# EasyEDA Pro project MeasuringCircuit_Hardware.epro

# Schematic powerdetect
Board Name: Board2; Create Date: 2025-07-30; Page Name: P1; Project Name: 25电赛工程; Schematic Name: powerdetect; Update Date: 2025-07-30; Company: 嘉立创EDA; Page Size: A4; Version: V1.0
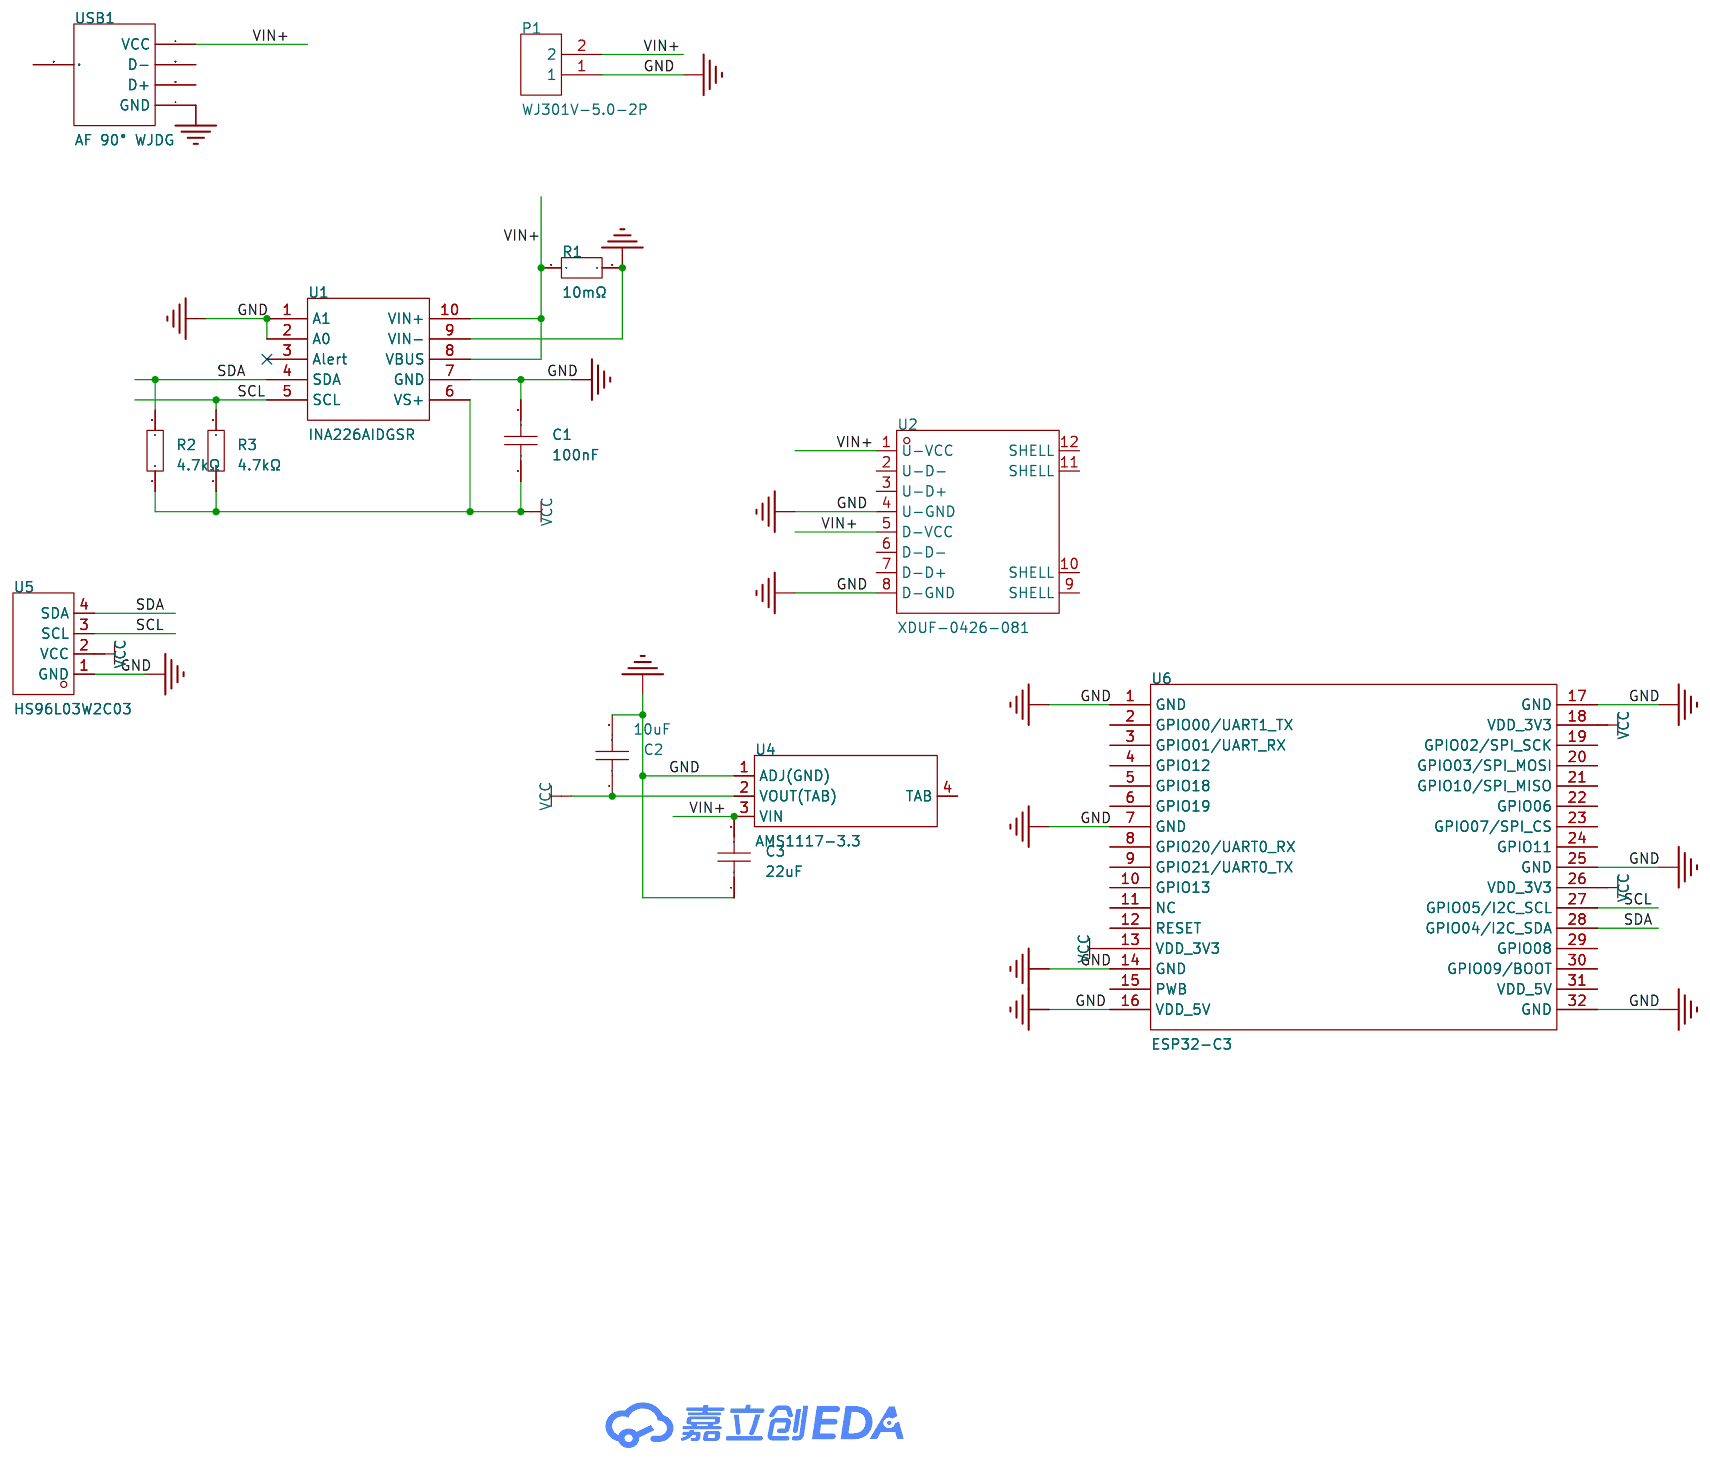
[diagram p0: schematic sheet]

## Parts
C1  100nF  [C0603]
C2  10uF  [C0603]
C3  22uF  [C0603]
P1  WJ301V-5.0-2P  [CONN-TH_2P-P5.00_WJ301V-5.00-2P]
R1  10mΩ  [R2512]
R2  4.7kΩ  [R0603]
R3  4.7kΩ  [R0603]
U1  INA226AIDGSR  [MSOP-10_L3.0-W3.0-P0.50-LS5.0-BL]
U2  XDUF-0426-081  [USB-A-TH_XDUF-0426-081]
U4  AMS1117-3.3  [SOT-223-4_L6.5-W3.5-P2.30-LS7.0-BR]
U5  HS96L03W2C03  [OLED-TH_L27.8-W27.2-P2.54_C9900033791]
U6  ESP32-C3  [ESP32-C3 114514]
USB1  AF 90° WJDG  [USB-A-TH_AF-WJDG]

## Library data of the parts
C1 = CC0603KRX7R9BB104: 容值:100nF;精度:±10%;额定电压:50V;温度系数:X7R;; LCSC Part Name: 100nF ±10% 50V; Supplier Part: C14663; Manufacturer: YAGEO(国巨); Supplier Footprint: 0603; JLCPCB Part Class: 基础库; Datasheet: https://atta.szlcsc.com/upload/public/pdf/source/20250214/096C4C206003071F5D32E5F0D8E7F8DF.pdf; Supplier: LCSC; Tolerance: ±10%; Voltage Rating: 50V; Temperature Coefficient: X7R
C2 = CGA0603X5R106K100JT: 容值:10uF;精度:±10%;额定电压:10V;温度系数:X5R;; LCSC Part Name: 10uF ±10% 10V; Supplier Part: C6119842; Manufacturer: HRE(芯声); Supplier Footprint: 0603; JLCPCB Part Class: 扩展库; Supplier: LCSC; Tolerance: ±10%; Voltage Rating: 10V; Temperature Coefficient: X5R
C3 = CGA0603X5R226M160JT: 容值:22uF;精度:±20%;额定电压:16V;温度系数:X5R;; LCSC Part Name: 22uF ±20% 16V; Supplier Part: C6119868; Manufacturer: HRE(芯声); Supplier Footprint: 0603; JLCPCB Part Class: 扩展库; Datasheet: https://atta.szlcsc.com/upload/public/pdf/source/20250121/36E435B8815E1026A710792D223DB526.pdf; Supplier: LCSC; Tolerance: ±20%; Voltage Rating: 16V; Temperature Coefficient: X5R
P1 = WJ301V-5.0-2P: 结构:1x2P;间距:5mm;颜色:蓝色;安装方式:直插;额定电流:17.5A;额定电压:250V;排数:1;线规 - AWG:14~22;线规 - 平方毫米:1.5;每排PIN数:2;工作温度范围:-30℃~+120℃;; LCSC Part Name: 5mm 1x2P 排数:1 每排P数:2 直插; Supplier Part: C8475; Manufacturer: KANGNEX(康奈克斯电气); Supplier Footprint: 插件,P=5mm; JLCPCB Part Class: 扩展库; Datasheet: https://atta.szlcsc.com/upload/public/pdf/source/20191225/C8475_44061C6AEE590DF3BFA2B6A28FAAB4F6.pdf; Supplier: LCSC; Structure: 1x2P; Pitch: 5mm; Color: 蓝色; Mounting Style: 直插; Current Rating (Max): 17.5A; Voltage Rating (Max): 250V; Number of Pins: 2P; Number of Rows: 1; Wire Gauge - AWG: 14~22; Wire Gauge - mm2: 1.5; Number of PINs Per Row: 2; Operating Temperature Range: -30℃~+120℃
R1 = YLR12-3-10F-W: 电阻类型:采样电阻;阻值:10mΩ;精度:±1%;额定压降:-;功率:3W;温度系数:±50ppm/℃;安装方式:贴片;; LCSC Part Name: 10mΩ ±1% 3W; Supplier Part: C489549; Manufacturer: yezhan(业展); Supplier Footprint: 2512; JLCPCB Part Class: 扩展库; Datasheet: https://atta.szlcsc.com/upload/public/pdf/source/20231030/FDDF433E22E82EEBC046C11DFDF78AD5.pdf; Supplier: LCSC; Type: 采样电阻; Tolerance: ±1%; Power(Watts): 3W; Temperature Coefficient: ±50ppm/℃; Mounting Sytle: 贴片
R2 R3 = 0603WAF4701T5E: 电阻类型:厚膜电阻;阻值:4.7kΩ;精度:±1%;功率:100mW;最大工作电压:75V;温度系数:±100ppm/℃;; LCSC Part Name: 4.7kΩ ±1% 100mW 厚膜电阻; Supplier Part: C23162; Manufacturer: UNI-ROYAL(厚声); Supplier Footprint: 0603; JLCPCB Part Class: 基础库; Datasheet: https://atta.szlcsc.com/upload/public/pdf/source/20200306/C422600_1E6D84923E4A46A82E41ADD87F860B5C.pdf; Supplier: LCSC; Type: 厚膜电阻; Tolerance: ±1%; Power(Watts): 100mW; Overload Voltage (Max): 75V; Temperature Coefficient: ±100ppm/℃; Operating Temperature Range: -55℃~+155℃
U1 = INA226AIDGSR: 放大器数:-;共模电压:300mV~40V;增益:-;带宽:-;; Supplier Part: C49851; Manufacturer: TI(德州仪器); Supplier Footprint: MSOP-10; JLCPCB Part Class: 扩展库; Datasheet: https://atta.szlcsc.com/upload/public/pdf/source/20231204/F50A9EB86BE78FEA83E070C913617774.pdf; Supplier: LCSC; Vcm - Common Mode Voltage: 300mV~40V; Voltage - Supply: 2.7V~5.5V; Operating Temperature: -40℃~+125℃
U2 = XDUF-0426-081: 连接器类型:Type-A;标准:USB 2.0;公母:母;安装方式:弯插;触点数量:8P;端口数量:2;额定电流 - 电源:3A;触头材质:-;触头镀层:金;工作温度范围:-40℃~+85℃;; LCSC Part Name: Type-A 母 弯插; Supplier Part: C18202150; Manufacturer: LX(连欣科技); Supplier Footprint: 插件; JLCPCB Part Class: 扩展库; Datasheet: https://atta.szlcsc.com/upload/public/pdf/source/20230927/84D0928CEEE7749C5A2EE15BD164E2D6.pdf; Supplier: LCSC; Connector Type: Type-A; Standard: USB 2.0; Gender: 母; Mounting Style: 弯插; Number of Contacts: 8P; Number of Ports: 2; Current Rating - Power (Max): 3A; Contact Plating: 金; Operating Temperature Range: -40℃~+85℃
U4 = AMS1117-3.3_C347222: 输出类型:固定;工作电压:12V;输出电压:3.3V;输出电流:1A;电源纹波抑制比(PSRR):60dB@(120Hz);输出极性:正极;; LCSC Part Name: 输出:3.3V 电流:1A 耐压:12V; Supplier Part: C347222; Manufacturer: UMW(友台半导体); Supplier Footprint: SOT-223; JLCPCB Part Class: 扩展库; Datasheet: https://atta.szlcsc.com/upload/public/pdf/source/20241218/BAF0263FA2E44BCD8AF41AA4FA04EFAA.pdf; Supplier: LCSC; Output Type: 固定; Voltage - Supply: 12V; Output Voltage: 3.3V; Output Current: 1A; Power Supply Rejection Ratio (PSRR): 60dB@(120Hz); Voltage Dropout: 1.3V@(1A); Features: 过流保护; Output Configuration: 正极; Number of Outputs: 1
U5 = HS96L03W2C03: 主控芯片:SSD1315;接口类型:I2C;尺寸(inch):0.96;像素分辨率:128x64;; LCSC Part Name: 0.96寸OLED显示屏窄白光IIC; Supplier Part: C5248080; Manufacturer: HS(汉昇); JLCPCB Part Class: 扩展库; Datasheet: https://atta.szlcsc.com/upload/public/pdf/source/20230627/763D01F79A90007632F098068C7C8AD9.pdf; Supplier: LCSC; Main Control Chip: SSD1315; Interface Type: I2C; Size: 0.96; Pixel Resolution: 128x64; Operating Temperature: -40℃~+70℃
U6 = ESP32-C3
USB1 = AF 90° WJDG: 连接器类型:Type-A;标准:USB 2.0;公母:母;安装方式:弯插;触点数量:4P;端口数量:1;额定电流 - 电源:1.5A;工作温度范围:-25℃~+85℃;; LCSC Part Name: Type-A 母 弯插; Supplier Part: C456018; Manufacturer: SHOU HAN(首韩); Supplier Footprint: 插件; JLCPCB Part Class: 扩展库; Datasheet: https://atta.szlcsc.com/upload/public/pdf/source/20241125/1CC41152EE29FFE03A5868591A920D3B.pdf; Supplier: LCSC; Connector Type: Type-A; Standard: USB 2.0; Gender: 母; Mounting Style: 弯插; Number of Contacts: 4P; Number of Ports: 1; Current Rating - Power (Max): 1.5A; Rated Voltage (Max): 30V; Connect-Disconnect Life: 5千次; Length: 14mm; Core Colour: 白色; Operating Temperature Range: -25℃~+85℃

## Nets
GND: C1.2 C2.2 C3.1 P1.1 R1.1 U1.1(A1) U1.2(A0) U1.7(GND) U1.9(VIN-) U2.4(U-GND) U2.8(D-GND) U4.1(ADJ(GND)) U5.1(GND) U6.1(GND) U6.7(GND) U6.14(GND) U6.16(VDD_5V) U6.17(GND) U6.25(GND) U6.32(GND) USB1.4(GND)
VCC: C1.1 C2.1 R2.1 R3.1 U1.6(VS+) U4.2(VOUT(TAB)) U5.2(VCC) U6.13(VDD_3V3) U6.18(VDD_3V3) U6.26(VDD_3V3)
VIN+: C3.2 P1.2 R1.2 U1.8(VBUS) U1.10(VIN+) U2.1(U-VCC) U2.5(D-VCC) U4.3(VIN) USB1.1(VCC)
SCL: R3.2 U1.5(SCL) U5.3(SCL) U6.27(GPIO05/I2C_SCL)
SDA: R2.2 U1.4(SDA) U5.4(SDA) U6.28(GPIO04/I2C_SDA)

Not connected (* = marked no-connect by the designer): U1 3(Alert)*; U2 2(U-D-) 3(U-D+) 6(D-D-) 7(D-D+) 9(SHELL) 10(SHELL) 11(SHELL) 12(SHELL); U4 4(TAB); U6 2(GPIO00/UART1_TX) 3(GPIO01/UART_RX) 4(GPIO12) 5(GPIO18) 6(GPIO19) 8(GPIO20/UART0_RX) 9(GPIO21/UART0_TX) 10(GPIO13) 11(NC) 12(RESET) 15(PWB) 19(GPIO02/SPI_SCK) 20(GPIO03/SPI_MOSI) 21(GPIO10/SPI_MISO) 22(GPIO06) 23(GPIO07/SPI_CS) 24(GPIO11) 29(GPIO08) 30(GPIO09/BOOT) 31(VDD_5V); USB1 2(D-) 3(D+) 5(SHLD)

# Board PCB2
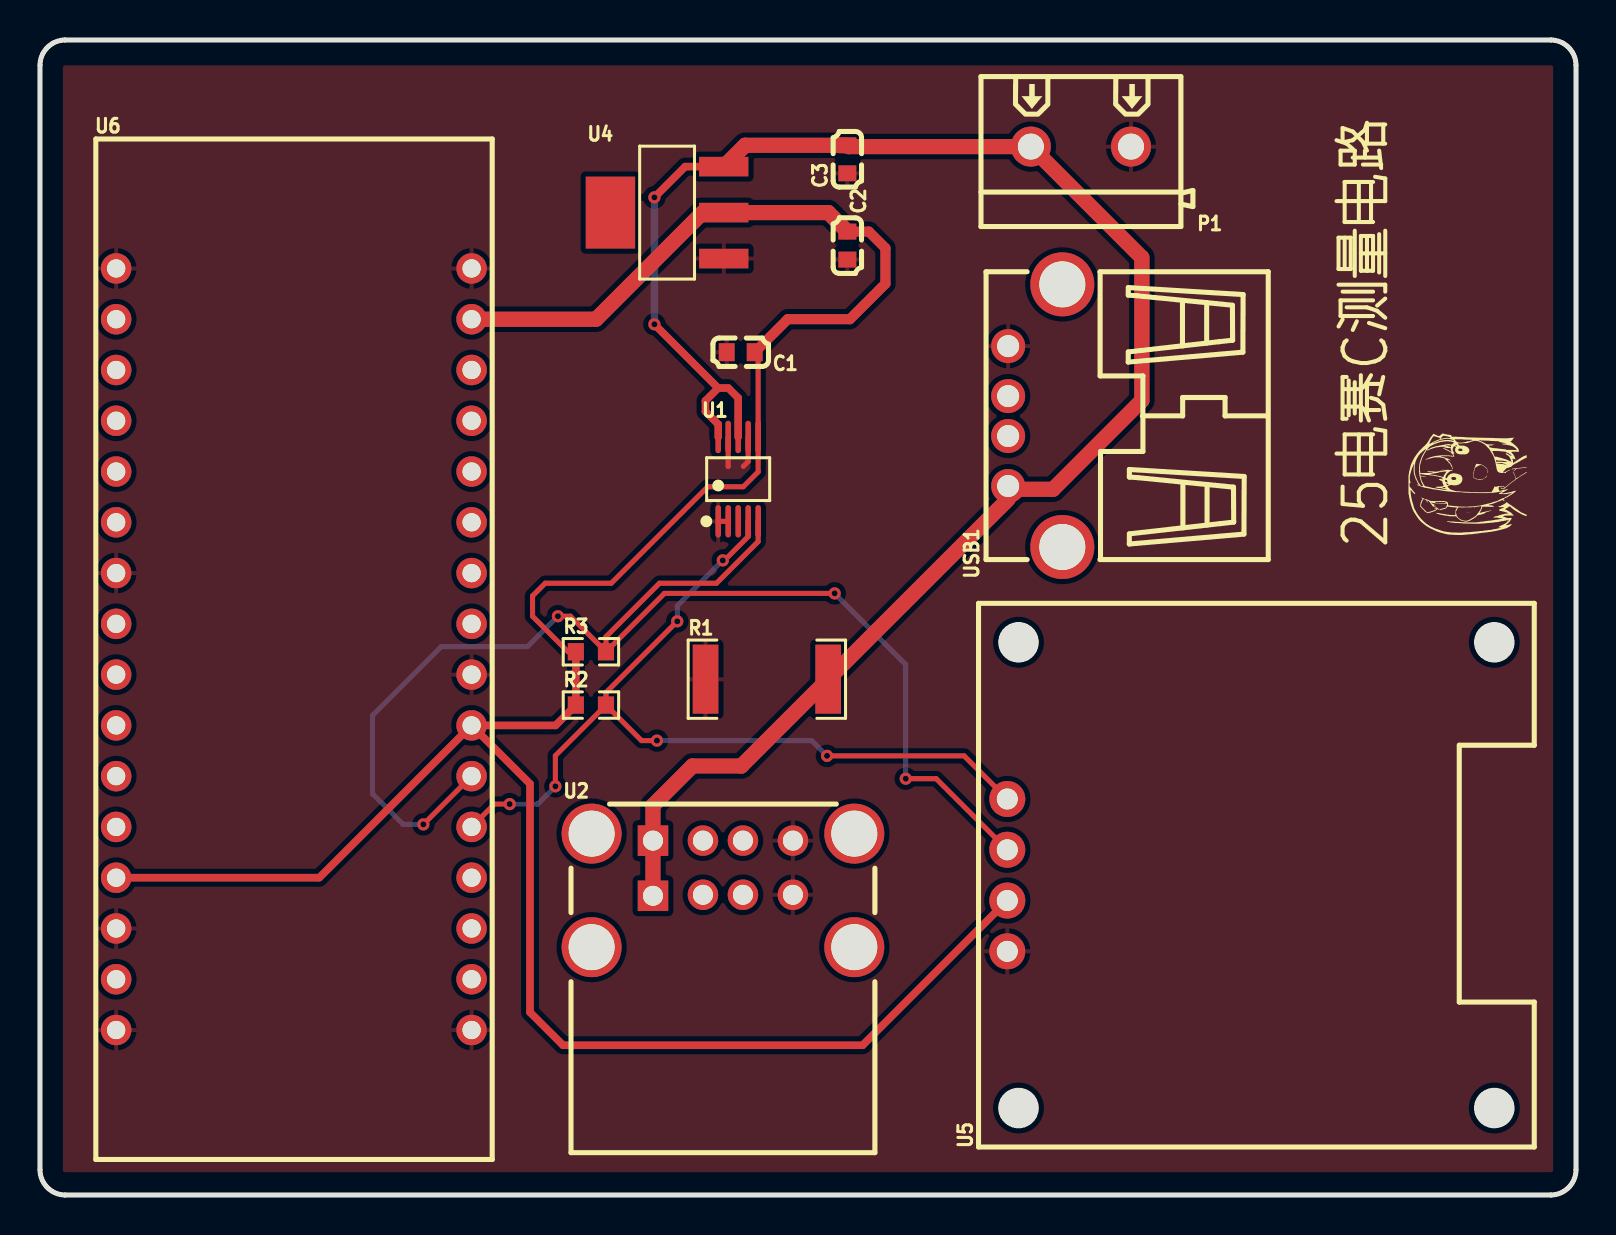
[diagram p1: board, top side]
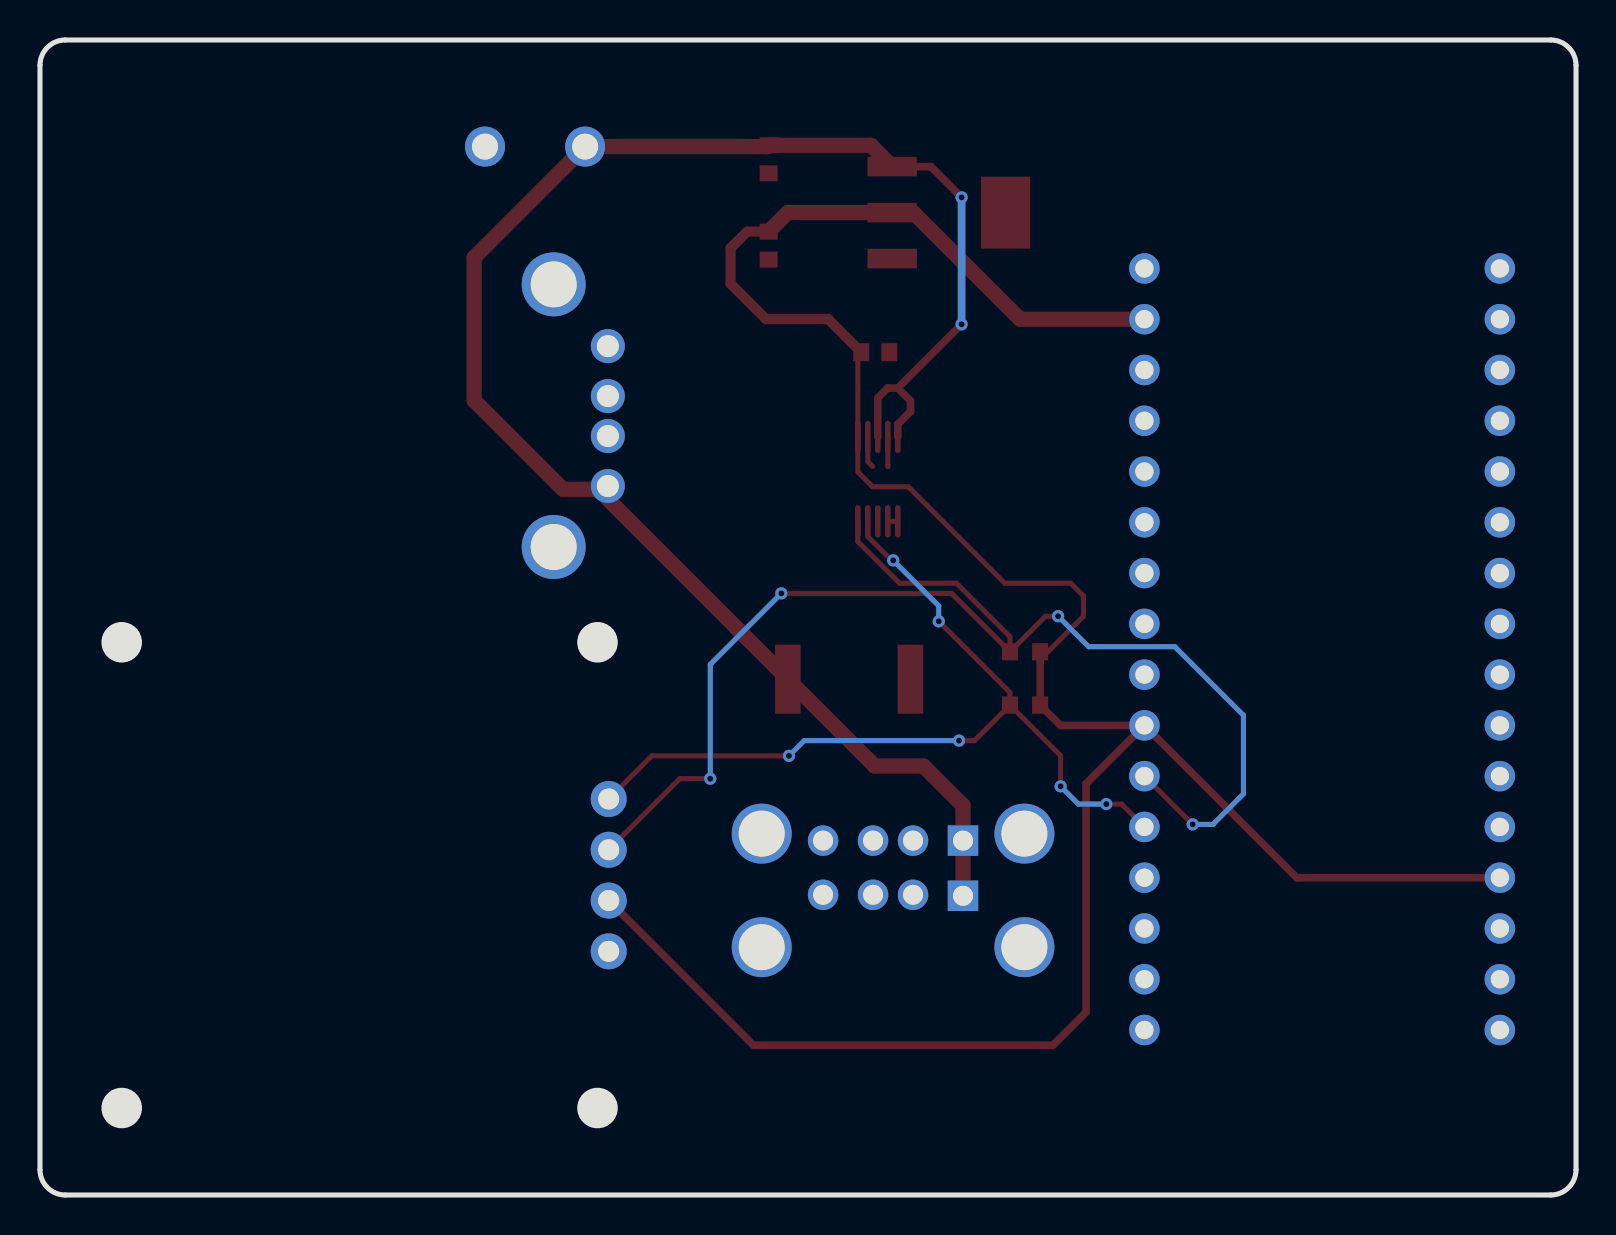
[diagram p2: board, bottom side, seen from below]

Outline 76.84 x 57.79 mm; copper layers: Top Layer, Bottom Layer. Coordinates in mm from the lower left corner of the outline.
Outline path: 0,56.52 0,1.27 arc(0.37,0.37) 1.27,0 75.56,0 arc(76.46,0.37) 76.84,1.27 76.84,56.52 arc(76.46,57.41) 75.56,57.79 1.27,57.79 arc(0.37,57.41) 0,56.52
Stack: Top Layer 0.035mm / Dielectric1 1.51mm FR4 er 4.5 / Bottom Layer 0.035mm

## Design rules (mm)
template: JLCPCB Capability(Two Layers Board)
spacing copperThickness1oz (default): track to track 0.102, other pairs 0.152 to 0.3
spacing copperThickness2oz: track to track 0.203, other pairs 0.152 to 0.3
track width copperThickness1oz (default): min 0.127, default 0.254, max 2.54
track width copperThickness2oz: min 0.203, default 0.254, max 2.54
differential pair differentialPair (default): width min 0.127, default 0.254, max 2.54; gap min 0.152, default 0.152
via viaSize (default): diameter min 0.5, default 0.61, max 10; hole min 0.3, default 0.305, max 6.3

## Placement (name value [footprint] x y rotation side)
C1  100nF  [C0603]  35.05 42.16 180 top
C2  10uF  [C0603]  40.39 47.5 270 top
C3  22uF  [C0603]  40.39 51.82 90 top
P1  WJ301V-5.0-2P  [CONN-TH_2P-P5.00_WJ301V-5.00-2P]  52.07 52.45 180 top
R1  10mΩ  [R2512]  36.36 25.81 0 top
R2  4.7kΩ  [R0603]  27.56 24.51 0 top
R3  4.7kΩ  [R0603]  27.56 27.18 0 top
U1  INA226AIDGSR  [MSOP-10_L3.0-W3.0-P0.50-LS5.0-BL]  34.92 35.81 0 top
U2  XDUF-0426-081  [USB-A-TH_XDUF-0426-081]  34.16 15.24 0 top
U4  AMS1117-3.3  [SOT-223-4_L6.5-W3.5-P2.30-LS7.0-BR]  31.37 49.15 0 top
U5  HS96L03W2C03  [OLED-TH_L27.8-W27.2-P2.54_C9900033791]  48.39 16 90 top
U6  ESP32-C3  [ESP32-C3 114514]  21.59 8.26 0 top
USB1  AF 90° WJDG  [USB-A-TH_AF-WJDG]  49.78 38.99 90 top

## Footprints (pads in the part's own frame, mm; a bottom-side part is the same pattern mirrored in y, then rotated)
C0603
  rect 0.8x0.9 smd: 1(-0.7,0) 2(0.7,0)
CONN-TH_2P-P5.00_WJ301V-5.00-2P
  round 2 hole 1.3: 1(-2.505,0) 2(2.505,0)
ESP32-C3 114514
  round 1.524 hole 0.914: 1(-17.78,38.1) 2(-17.78,35.56) 3(-17.78,33.02) 4(-17.78,30.48) 5(-17.78,27.94) 6(-17.78,25.4) 7(-17.78,22.86) 8(-17.78,20.32) 9(-17.78,17.78) 10(-17.78,15.24) 11(-17.78,12.7) 12(-17.78,10.16) 13(-17.78,7.62) 14(-17.78,5.08) 15(-17.78,2.54) 16(-17.78,0) 17(0,38.1) 18(0,35.56) 19(0,33.02) 20(0,30.48) 21(0,27.94) 22(0,25.4) 23(0,22.86) 24(0,20.32) 25(0,17.78) 26(0,15.24) 27(0,12.7) 28(0,10.16) 29(0,7.62) 30(0,5.08) 31(0,2.54) 32(0,0)
MSOP-10_L3.0-W3.0-P0.50-LS5.0-BL
  oval 0.28x1.62 smd: 1(-1,-2.11) 2(-0.5,-2.11) 3(0,-2.11) 4(0.5,-2.11) 5(1,-2.11) 6(1,2.11) 7(0.5,2.11) 8(0,2.11) 9(-0.5,2.11) 10(-1,2.11)
OLED-TH_L27.8-W27.2-P2.54_C9900033791
  round 1.8 hole 1.05: 1(-3.81,0) 2(-1.27,0) 3(1.27,0) 4(3.81,0)
R0603
  rect 0.806x0.864 smd: 1(-0.753,0) 2(0.753,0)
R2512
  rect 1.282x3.456 smd: 1(-3.067,0) 2(3.067,0)
SOT-223-4_L6.5-W3.5-P2.30-LS7.0-BR
  rect 2.47x0.98 smd: 1(2.835,-2.3) 2(2.835,0) 3(2.835,2.3)
  rect 2.47x3.6 smd: 4(-2.835,0)
USB-A-TH_AF-WJDG
  round 1.7 hole 1.1: 1(-3.521,1.355) 2(-1.018,1.355) 3(0.981,1.355) 4(3.48,1.355)
  round 3.2 hole 2.3: 5(-6.57,-1.355) 5(6.57,-1.355)
USB-A-TH_XDUF-0426-081
  rect 1.524x1.524 hole 1: 1(-3.5,2.49) 5(-3.5,-0.27)
  round 1.524 hole 1: 2(-1,2.49) 3(1,2.49) 4(3.5,2.49) 6(-1,-0.22) 7(1,-0.22) 8(3.5,-0.22)
  round 3 hole 2.3: 9(-6.57,2.84) 10(6.57,2.84) 11(-6.57,-2.84) 12(6.57,-2.84)

## Nets
As in the schematic.

Pads without a net: U1 3; U2 2 3 6 7 9 10 11 12; U4 4; U6 2 3 4 5 6 8 9 10 11 12 15 19 20 21 22 23 24 29 30 31; USB1 2 3 5

## Via types
v1: diameter 0.61, hole 0.305, Top Layer to Bottom Layer, 12 vias

## Routing (per net, layer and track width the routed paths; a pad name or vN(x,y) marks a point on that pad's centre or on a via; arc(x,y) is an arc through that point)
GND: length 3.6
  Top Layer w0.254: U1.7 35.42,36.7 35.18,36.45 ; 34.42,36.45 34.42,36.46 U1.9 ; U1.1 U1.2
VCC: length 129.6
  Top Layer w0.254: C1.1 35.92,41.99 U1.6 35.92,36.18 35.18,35.43 33.4,35.43 28.57,30.61 25.27,30.61 24.64,29.97 24.64,28.96 26.42,27.18 R3.1
  Top Layer w0.381: U6.13 13.97,15.88 U6.26 ; U5.2 41.15,7.49 26.16,7.49 24.51,9.14 24.51,20.57 U6.26 ; U6.26 25.79,23.5 R2.1 R3.1
  Top Layer w0.508: C1.1 37.4,43.82 40.51,43.82 42.29,45.59 42.29,47.37 41.46,48.2 C2.1
  Top Layer w0.762: U6.18 27.81,43.82 33.15,49.15 U4.2 39.44,49.15 C2.1
VIN+: length 89
  Top Layer w0.381: v1(30.73,49.91) 32.27,51.45 U4.3 ; U1.8 34.92,39.88 34.43,40.37 33.92,40.37 ; 33.92,40.37 33.29,39.73 33.29,39.2 33.92,38.56 U1.10 ; 33.92,40.37 v1(30.73,43.56)
  Top Layer w0.762: USB1.1 48.43,35.31 ; U2.5 U2.1 30.66,19.49 32.64,21.46 35.08,21.46 R1.2 48.43,34.81 ; 48.64,35.31 50.67,35.31 55.12,39.75 55.12,46.9 P1.2 40.45,52.45 C3.2 35.27,52.52 U4.3
  Bottom Layer w0.381: v1(30.73,43.56) v1(30.73,49.91)
SCL: length 66.3
  Top Layer w0.254: U1.5 35.92,32.69 33.84,30.61 30.99,30.61 28.31,27.93 R3.2 ; R3.2 31.23,30.1 v1(39.75,30.1) ; R3.2 26.53,28.96 v1(25.91,28.96) ; U5.3 44.83,20.83 v1(43.31,20.83) ; U6.27 v1(19.18,18.54)
  Bottom Layer w0.254: v1(43.31,20.83) 43.31,26.54 v1(39.75,30.1) ; v1(25.91,28.96) 24.38,27.43 20.07,27.43 16.64,24 16.64,20.07 18.16,18.54 v1(19.18,18.54)
SDA: length 44.4
  Top Layer w0.254: U5.4 46.23,21.97 v1(39.37,21.97) ; v1(31.88,28.7) 28.31,25.14 R2.2 ; R2.2 25.78,21.98 v1(25.78,20.45) ; R2.2 30.09,22.73 v1(30.86,22.73) ; v1(23.5,19.56) 22.73,19.56 U6.28 ; v1(34.16,31.75) 34.23,31.75 35.42,32.94 U1.4
  Bottom Layer w0.254: v1(39.37,21.97) 38.61,22.73 v1(30.86,22.73) ; v1(25.78,20.45) 24.89,19.56 v1(23.5,19.56) ; v1(34.16,31.75) 31.88,29.47 v1(31.88,28.7)

## Copper pours and planes (outline as drawn; the poured copper is in the pictures)
GND on Top Layer: 1.14,56.52 75.69,56.52 75.69,1.14 1.14,1.14

## Text on the board
Top Silkscreen Layer: 25电赛C测量电路
